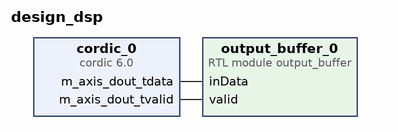
[diagram p0: block diagram of the top level]
# Vivado block design design_dsp, xc7z020clg484-1, Vivado 2018.2
create_bd_design design_dsp

create_bd_cell -type ip -vlnv xilinx.com:ip:cordic:6.0 cordic_0
set_property -dict [list \
  CONFIG.Functional_Selection Sin_and_Cos \
  CONFIG.Pipelining_Mode Optimal \
  CONFIG.Data_Format SignedFraction \
  CONFIG.Phase_Format Scaled_Radians \
  CONFIG.Coarse_Rotation false \
] [get_bd_cells cordic_0]
create_bd_cell -type module -reference output_buffer output_buffer_0

# ---- connections ----

connect_bd_net [get_bd_pins cordic_0/m_axis_dout_tdata] [get_bd_pins output_buffer_0/inData]
connect_bd_net [get_bd_pins cordic_0/m_axis_dout_tvalid] [get_bd_pins output_buffer_0/valid]

validate_bd_design
save_bd_design
